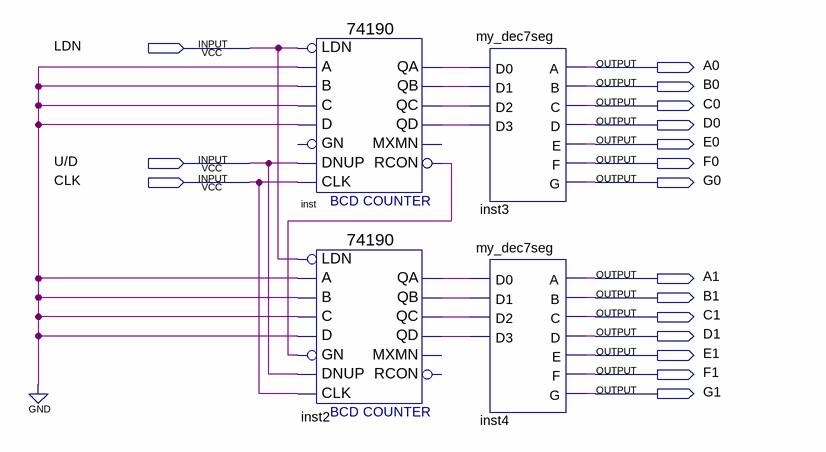
[diagram p0: schematic sheet]
// Quartus schematic contador_2dig.bdf as structural Verilog: 4 symbols, 17 pins
module contador_2dig (
  input  LDN,
  input  \U/D ,
  input  CLK,
  output A0,
  output B0,
  output C0,
  output D0,
  output E0,
  output F0,
  output G0,
  output A1,
  output B1,
  output C1,
  output D1,
  output E1,
  output F1,
  output G1
);

  wire inst2_qa, inst2_qb, inst2_qc, inst2_qd, inst_qa, inst_qb, inst_qc, inst_qd, inst_rcon;

  \74190  inst (
    .LDN(LDN), .A(1'b0), .C(1'b0), .B(1'b0), .D(1'b0), .CLK(CLK), .DNUP(\U/D ), .QA(inst_qa), .QB(inst_qb),
    .QD(inst_qd), .QC(inst_qc), .RCON(inst_rcon));  // open: GN, MXMN
  \74190  inst2 (
    .LDN(LDN), .A(1'b0), .C(1'b0), .B(1'b0), .D(1'b0), .GN(inst_rcon), .CLK(CLK), .DNUP(\U/D ),
    .QA(inst2_qa), .QB(inst2_qb), .QD(inst2_qd), .QC(inst2_qc));  // open: MXMN, RCON
  my_dec7seg inst3 (
    .D3(inst_qd), .D2(inst_qc), .D1(inst_qb), .D0(inst_qa), .A(A0), .B(B0), .C(C0), .D(D0), .E(E0), .F(F0),
    .G(G0));
  my_dec7seg inst4 (
    .D3(inst2_qd), .D2(inst2_qc), .D1(inst2_qb), .D0(inst2_qa), .A(A1), .B(B1), .C(C1), .D(D1), .E(E1),
    .F(F1), .G(G1));
endmodule
